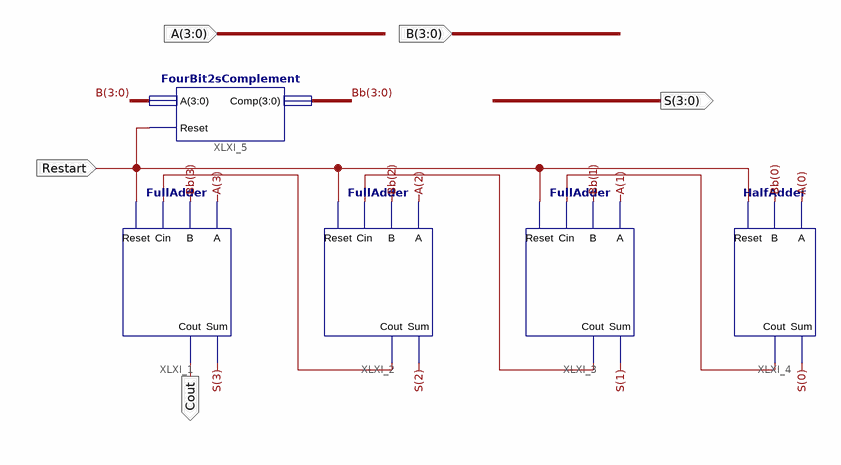
[diagram p0: schematic sheet 1]
// Xilinx ISE schematic FourBitSubtractor.sch (artix7) as structural Verilog: 5 symbols, 5 ports
module FourBitSubtractor (
  input  Restart,
  input  [3:0] B,
  input  [3:0] A,
  output Cout,
  output [3:0] S
);

  wire XLXN_5, XLXN_6, XLXN_8;
  wire [3:0] Bb;

  FullAdder XLXI_1 (.A(A[3]), .B(Bb[3]), .Cin(XLXN_8), .Cout(Cout), .Reset(Restart), .Sum(S[3]));
  FullAdder XLXI_2 (.A(A[2]), .B(Bb[2]), .Cin(XLXN_6), .Cout(XLXN_8), .Reset(Restart), .Sum(S[2]));
  FullAdder XLXI_3 (.A(A[1]), .B(Bb[1]), .Cin(XLXN_5), .Cout(XLXN_6), .Reset(Restart), .Sum(S[1]));
  HalfAdder XLXI_4 (.A(A[0]), .B(Bb[0]), .Cout(XLXN_5), .Reset(Restart), .Sum(S[0]));
  FourBit2sComplement XLXI_5 (.A(B), .Comp(Bb), .Reset(Restart));
endmodule
